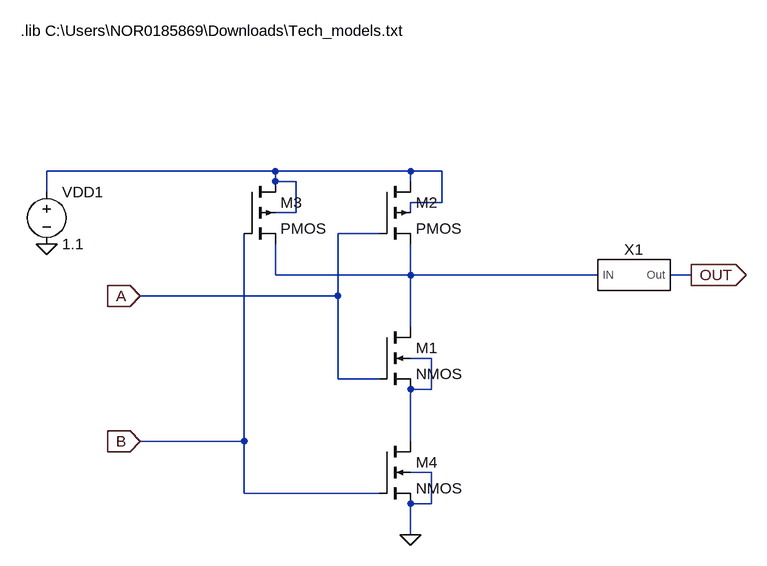
[diagram p0: schematic ANDgate.asc]
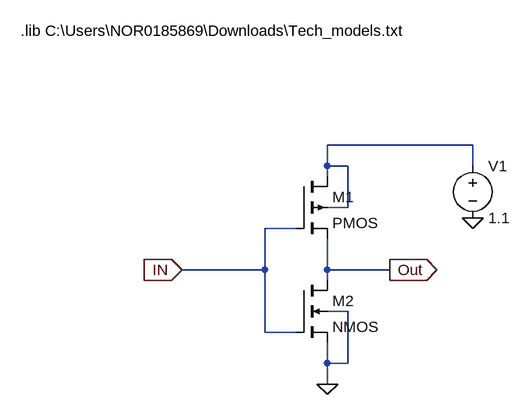
[diagram p1: sub-circuit inverter.asc]
ANDgate.asc, the LTspice schematic file:
Version 4
SHEET 1 924 680
WIRE 176 -32 -176 -32
WIRE 384 -32 176 -32
WIRE 432 -32 384 -32
WIRE 176 -16 176 -32
WIRE 208 -16 176 -16
WIRE 384 -16 384 -32
WIRE -176 0 -176 -32
WIRE 432 16 432 -32
WIRE 432 16 384 16
WIRE 208 32 208 -16
WIRE 208 32 176 32
WIRE 384 32 384 16
WIRE 336 64 272 64
WIRE 176 128 176 80
WIRE 384 128 384 80
WIRE 384 128 176 128
WIRE 672 128 384 128
WIRE 816 128 784 128
WIRE 272 160 272 64
WIRE 272 160 -32 160
WIRE 384 208 384 128
WIRE 416 256 384 256
WIRE 272 288 272 160
WIRE 336 288 272 288
WIRE 416 304 416 256
WIRE 416 304 384 304
WIRE 128 384 128 64
WIRE 128 384 -32 384
WIRE 384 384 384 304
WIRE 416 432 384 432
WIRE 128 464 128 384
WIRE 336 464 128 464
WIRE 416 480 416 432
WIRE 416 480 384 480
WIRE 384 528 384 480
FLAG -176 80 0
FLAG 384 528 0
FLAG -32 160 A
IOPIN -32 160 In
FLAG -32 384 B
IOPIN -32 384 In
FLAG 816 128 OUT
IOPIN 816 128 Out
SYMBOL nmos4 336 208 R0
SYMATTR InstName M1
SYMATTR Value2 l=32n w=64n
SYMBOL pmos4 336 -16 R0
SYMATTR InstName M2
SYMATTR Value2 l=32n w=128n
SYMBOL pmos4 128 -16 R0
SYMATTR InstName M3
SYMATTR Value2 l=32n w=128n
SYMBOL nmos4 336 384 R0
SYMATTR InstName M4
SYMATTR Value2 l=32n w=64n
SYMBOL voltage -176 -16 R0
WINDOW 123 0 0 Left 0
WINDOW 39 0 0 Left 0
SYMATTR InstName VDD1
SYMATTR Value 1.1
SYMBOL inverter 720 128 R0
SYMATTR InstName X1
TEXT -216 -248 Left 2 !.lib C:\\Users\\NOR0185869\\Downloads\\Tech_models.txt

inverter.asc, the sub-circuit schematic file:
Version 4
SHEET 1 880 680
WIRE 560 144 336 144
WIRE 336 176 336 144
WIRE 368 176 336 176
WIRE 560 176 560 144
WIRE 336 192 336 176
WIRE 368 240 368 176
WIRE 368 240 336 240
WIRE 288 272 240 272
WIRE 240 336 240 272
WIRE 240 336 112 336
WIRE 336 336 336 288
WIRE 432 336 336 336
WIRE 336 352 336 336
WIRE 368 400 336 400
WIRE 240 432 240 336
WIRE 288 432 240 432
WIRE 336 480 336 448
WIRE 368 480 368 400
WIRE 368 480 336 480
WIRE 336 512 336 480
FLAG 560 256 0
FLAG 336 512 0
FLAG 112 336 IN
IOPIN 112 336 In
FLAG 432 336 Out
IOPIN 432 336 Out
SYMBOL pmos4 288 192 R0
SYMATTR InstName M1
SYMATTR Value2 l=32n w=64n
SYMBOL nmos4 288 352 R0
SYMATTR InstName M2
SYMATTR Value2 l=32n w=64n
SYMBOL voltage 560 160 R0
WINDOW 123 0 0 Left 0
WINDOW 39 0 0 Left 0
SYMATTR InstName V1
SYMATTR Value 1.1
TEXT -136 -32 Left 2 !.lib C:\\Users\\NOR0185869\\Downloads\\Tech_models.txt

The netlist it stands for:
* ANDgate.asc
M1 N002 A N003 N003 NMOS l=32n w=64n
M2 N001 A N002 N001 PMOS l=32n w=128n
M3 N001 B N002 N001 PMOS l=32n w=128n
M4 N003 B 0 0 NMOS l=32n w=64n
VDD1 N001 0 1.1
XX1 N002 OUT inverter

* block symbol definitions
.subckt inverter IN Out
M1 N001 IN Out N001 PMOS l=32n w=64n
M2 Out IN 0 0 NMOS l=32n w=64n
V1 N001 0 1.1
.lib C:\Users\NOR0185869\Downloads\Tech_models.txt
.ends inverter

.model NMOS NMOS
.model PMOS PMOS
.lib standard.mos
.lib C:\Users\NOR0185869\Downloads\Tech_models.txt
.backanno
.end